# EAGLE schematic SCH (EAGLE 8.2.2)
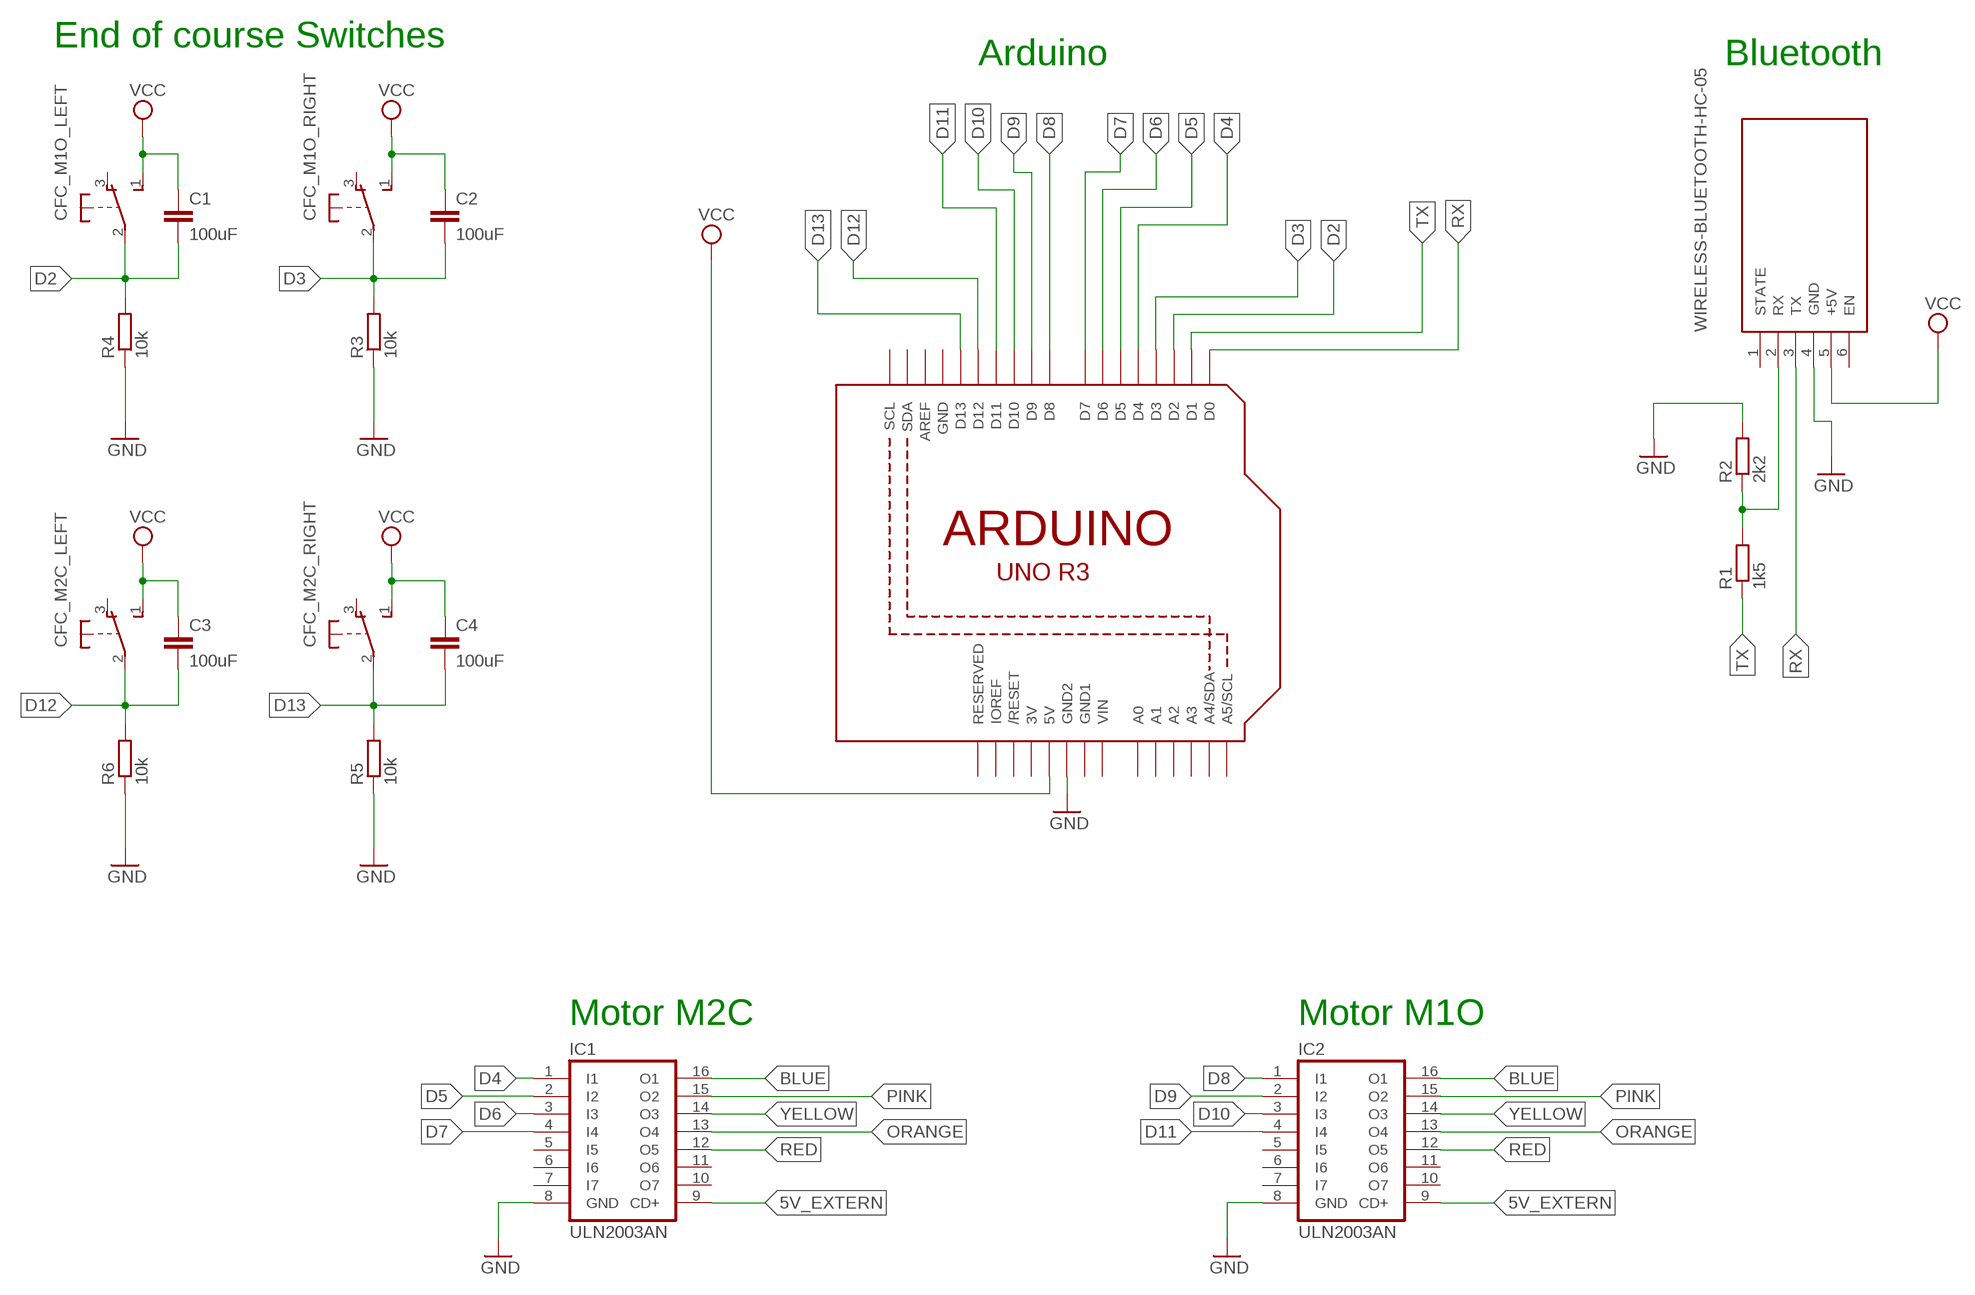
[diagram p0: schematic, sheet 1]

## Parts
C1  100uF  C2,5-3  [C2.5-3]
C2  100uF  C2,5-3  [C2.5-3]
C3  100uF  C2,5-3  [C2.5-3]
C4  100uF  C2,5-3  [C2.5-3]
CFC_M1O_LEFT  9450-1  [9450-1]
CFC_M1O_RIGHT  9450-1  [9450-1]
CFC_M2C_LEFT  9450-1  [9450-1]
CFC_M2C_RIGHT  9450-1  [9450-1]
IC1  ULN2003AN  [DIL16]
IC2  ULN2003AN  [DIL16]
R1  1k5  R-EU_0204/5  [0204/5]
R2  2k2  R-EU_0204/5  [0204/5]
R3  10k  R-EU_0204/5  [0204/5]
R4  10k  R-EU_0204/5  [0204/5]
R5  10k  R-EU_0204/5  [0204/5]
R6  10k  R-EU_0204/5  [0204/5]
U1  ARDUINOR3-DIMENSION  [ARDUINOR3]
WIRELESS-BLUETOOTH-HC-05  WIRELESS-BLUETOOTH-HC-05  [WIRELESS-BLUETOOTH-HC-05]

## Nets
5V_EXTERN: IC1.9(CD+) IC2.9(CD+)
BLUE: IC1.16(O1) IC2.16(O1)
D2: C1.2 CFC_M1O_LEFT.2(P) R4.2 U1.D2
D3: C2.2 CFC_M1O_RIGHT.2(P) R3.2 U1.D3
D4: IC1.1(I1) U1.D4
D5: IC1.2(I2) U1.D5
D6: IC1.3(I3) U1.D6
D7: IC1.4(I4) U1.D7
D8: IC2.1(I1) U1.D8
D9: IC2.2(I2) U1.D9
D10: IC2.3(I3) U1.D10
D11: IC2.4(I4) U1.D11
D12: C3.2 CFC_M2C_LEFT.2(P) R6.2 U1.D12
D13: C4.2 CFC_M2C_RIGHT.2(P) R5.2 U1.D13
GND: IC1.8(GND) IC2.8(GND) R2.2 R3.1 R4.1 R5.1 R6.1 U1.GND2 WIRELESS-BLUETOOTH-HC-05.4(GND)
N$2: R1.2 R2.1 WIRELESS-BLUETOOTH-HC-05.2(RX)
ORANGE: IC1.13(O4) IC2.13(O4)
PINK: IC1.15(O2) IC2.15(O2)
RED: IC1.12(O5) IC2.12(O5)
RX: U1.D0 WIRELESS-BLUETOOTH-HC-05.3(TX)
TX: R1.1 U1.D1
VCC: C1.1 C2.1 C3.1 C4.1 CFC_M1O_LEFT.1(S) CFC_M1O_RIGHT.1(S) CFC_M2C_LEFT.1(S) CFC_M2C_RIGHT.1(S) U1.5V WIRELESS-BLUETOOTH-HC-05.5(+5V)
YELLOW: IC1.14(O3) IC2.14(O3)
Unconnected: CFC_M1O_LEFT.3(O) CFC_M1O_RIGHT.3(O) CFC_M2C_LEFT.3(O) CFC_M2C_RIGHT.3(O) IC1.5(I5) IC1.6(I6) IC1.7(I7) IC1.10(O7) IC1.11(O6) IC2.5(I5) IC2.6(I6) IC2.7(I7) IC2.10(O7) IC2.11(O6) U1.A0 U1.A1 U1.A2 U1.A3 U1.A4(A4/SDA) U1.A5(A5/SCL) U1.AREF U1.IOREF U1.RESERVED U1.RESET(/RESET) U1.SCL U1.SDA WIRELESS-BLUETOOTH-HC-05.1(STATE) WIRELESS-BLUETOOTH-HC-05.6(EN)

## Notes on the sheet
- End of course Switches
- Arduino | Bluetooth
- Motor M2C | Motor M1O

## Power pins joined to a net without a drawn wire
3V: U1.3V
GND: U1.GND
GND1: U1.GND1
VIN: U1.VIN

## Library data of the parts
C1-C4 = capacitor-wima:C: CAPACITOR naming: grid - package width
CFC_M1O_LEFT CFC_M1O_RIGHT CFC_M2C_LEFT CFC_M2C_RIGHT = switch-misc:9450-1: MARQUARDT SWITCH
IC1 IC2 = uln-udn:ULN2003A: DRIVER ARRAY
R1-R6 = resistor:R-EU_: RESISTOR, European symbol
U1 = adafruit:ARDUINOR3: This is a new object for the new Arduino R3 - with extra pins that you may want to use (such as IOref, and duplicated A4/A5
WIRELESS-BLUETOOTH-HC-05 = diy-modules:WIRELESS-BLUETOOTH-HC-05: Bluetooth Transceiver Module based on HC-05 board Tutorial is available here: https://arduino-info.wikispaces.com/BlueTooth-HC05-HC06-Modules-How-To Click here to find device on ebay.com <http://www.ebay.com/sch/hc-05+module+rs232>